# EAGLE design Encoder_robo (EAGLE 9.0.0)
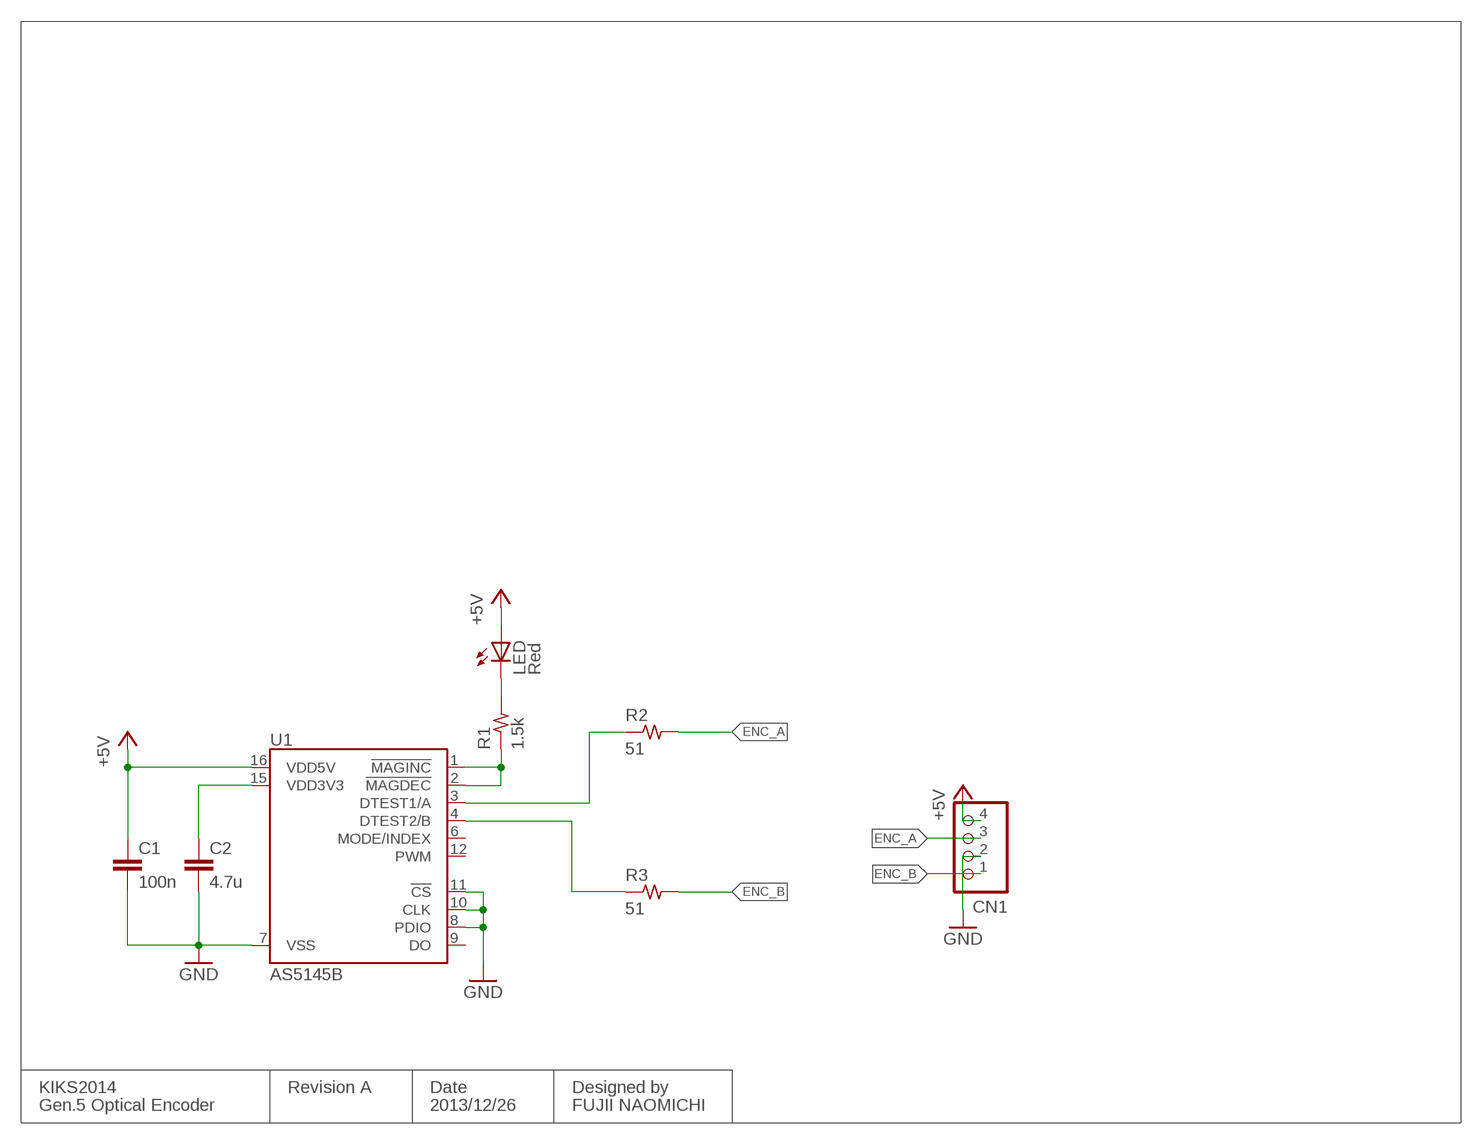
[diagram p0: schematic, sheet 1]

## Parts
C1  100n  C1608  [1608]
C2  4.7u  C1608  [1608]
CN1  S4B-XH-A  [S4B-XH-A]
LED  Red  LED3MM  [LED3MM]
R1  1.5k  R1608  [1608]
R2  51  R1608  [1608]
R3  51  R1608  [1608]
U1  AS5145B  [SSOP16]

## Nets
+5V: C1.1 CN1.4 LED.A U1.16(VDD5V)
ENC_A: CN1.3 R2.2
ENC_B: CN1.1 R3.2
GND: C1.2 C2.2 CN1.2 U1.7(VSS) U1.8(PDIO) U1.10(CLK) U1.11(!CS)
N$1: R2.1 U1.3(DTEST1/A)
N$2: C2.1 U1.15(VDD3V3)
N$3: R3.1 U1.4(DTEST2/B)
N$4: LED.K(C) R1.2
N$5: R1.1 U1.1(!MAGINC) U1.2(!MAGDEC)
Unconnected: U1.6(MODE/INDEX) U1.9(DO) U1.12(PWM)

## Notes on the sheet
- KIKS2014 | Revision A | Date | Designed by
- Gen.5 Optical Encoder | 2013/12/26 | FUJII NAOMICHI

## Library data of the parts
C1 C2 = Passive:C
CN1 = jst-xh:S4B-XH-A: Wire-to-Board 2.5mm pitch side mount connector Source: http://www.jst-mfg.com/product/pdf/jpn/XH.pdf http://www.jst-mfg.com/product/detail.php?series=277
LED = led:LED: LED OSRAM: - CHIPLED LG R971, LG N971, LY N971, LG Q971, LY Q971, LO R971, LY R971 LH N974, LH R974 LS Q976, LO Q976, LY Q976 LO Q996 - Hyper CHIPLED LW Q18S LB Q993, LB Q99A, LB R99A - SideLED LS A670, LO A670, LY A670, LG A670, LP A670 LB A673, LV A673, LT A673, LW A673 LH A674 LY A675 LS A676, LA A676, LO A676, LY A676, LW A676 LS A679, LY A679, LG A679 - Hyper Micro SIDELED® LS Y876, LA Y876, LO Y876, LY Y876 LT Y87S - SmartLED LW L88C, LW L88S LB L89C, LB L89S, LG L890 LS L89K, LO L89K, LY L89K LS L896, LA L896, LO L896, LY L896 - TOPLED LS T670, LO T670, LY T670, LG T670, LP T670 LSG T670, LSP T670, LSY T670, LOP T670, LYG T670 LG T671, LOG T671, LSG T671 LB T673, LV T673, LT T673, LW T673 LH T674 LS T676, LA T676, LO T676, LY T676, LB T676, LH T676, LSB T676, LW T676 LB T67C, LV T67C, LT T67C, LS T67K, LO T67K, LY T67K, LW E67C LS E67B, LA E67B, LO E67B, LY E67B, LB E67C, LV E67C, LT E67C LW T67C LS T679, LY T679, LG T679 LS T770, LO T770, LY T770, LG T770, LP T770 LB T773, LV T773, LT T773, LW T773 LH T774 LS E675, LA E675, LY E675, LS T675 LS T776, LA T776, LO T776, LY T776, LB T776 LHGB T686 LT T68C, LB T68C - Hyper Mini TOPLED® LB M676 - Mini TOPLED Santana® LG M470 LS M47K, LO M47K, LY M47K Source: http://www.osram.convergy.de LUXEON: - LUMILED® LXK2-PW12-R00, LXK2-PW12-S00, LXK2-PW14-U00, LXK2-PW14-V00 LXK2-PM12-R00, LXK2-PM12-S00, LXK2-PM14-U00 LXK2-PE12-Q00, LXK2-PE12-R00, LXK2-PE12-S00, LXK2-PE14-T00, LXK2-PE14-U00 LXK2-PB12-K00, LXK2-PB12-L00, LXK2-PB12-M00, LXK2-PB14-N00, LXK2-PB14-P00, LXK2-PB14-Q00 LXK2-PR12-L00, LXK2-PR12-M00, LXK2-PR14-Q00, LXK2-PR14-R00 LXK2-PD12-Q00, LXK2-PD12-R00, LXK2-PD12-S00 LXK2-PH12-R00, LXK2-PH12-S00 LXK2-PL12-P00, LXK2-PL12-Q00, LXK2-PL12-R00 Source: www.luxeon.com KINGBRIGHT: KA-3528ASYC Source: www.kingbright.com
R1-R3 = Passive:R
U1 = ic-ams:AS5145

## Board
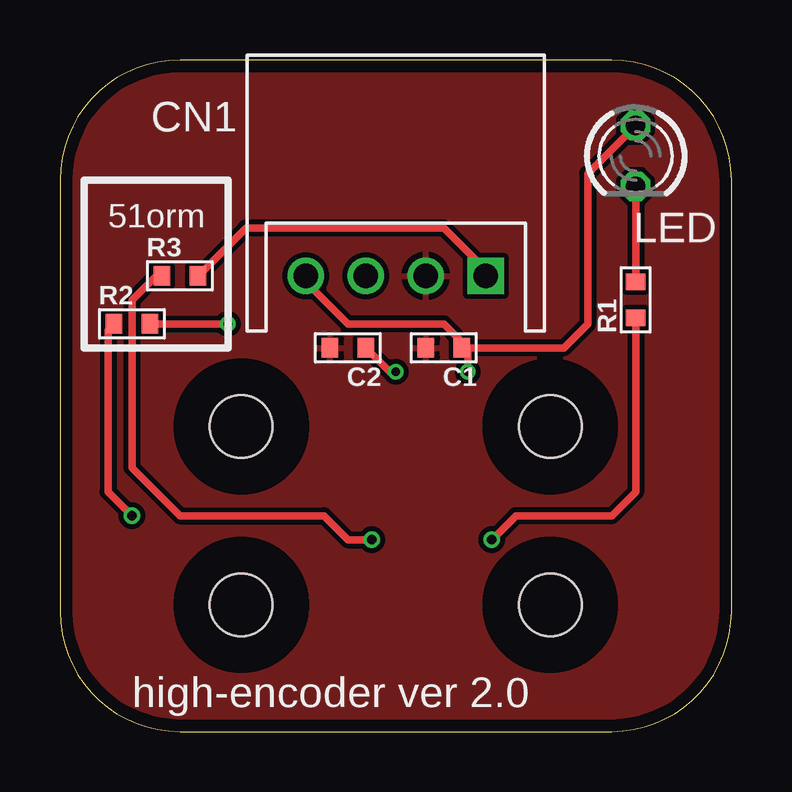
[diagram p1: board, top side]
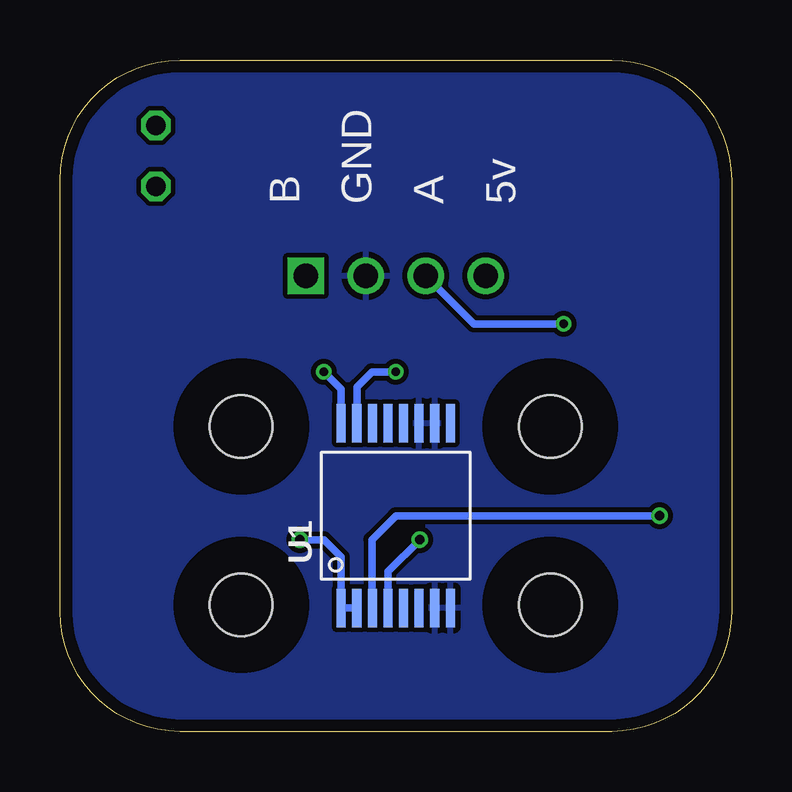
[diagram p2: board, bottom side, seen from below]

Size 28 x 28 mm. Coordinates in mm from the lower left corner, seen from the top.
Outline: 5,0 23,0 arc90 28,5 28,23 arc90 23,28 5,28 arc90 0,23 0,5 arc90 5,0
Copper layers (1*16): Top 0.035mm / dielectric 1.6mm / Bottom 0.035mm
Design rules "Elecrow_2-layer_PCB_eagle_rule": minimum track width 6mil, minimum drill 12mil, track to track 6mil, track to pad 6mil, pad to pad 6mil, via to via 8mil, smd to smd 0mil, copper to edge 20mil, drill to drill 10mil, minimum pad ring 6mil, minimum via ring 6mil, stop-mask expansion 0mil, vias tented up to drill 100mil, thermal gap 10mil
Holes 2.6 mm at 7.56,5.28 20.44,12.72 7.56,12.72 20.44,5.28
tRestrict: area 5.1,2.8 to 10.1,7.8; area 17.9,10.2 to 22.9,15.2; area 5.1,10.2 to 10.1,15.2; area 17.9,2.8 to 22.9,7.8
bRestrict: area 5.1,2.8 to 10.1,7.8; area 17.9,10.2 to 22.9,15.2; area 5.1,10.2 to 10.1,15.2; area 17.9,2.8 to 22.9,7.8

### Footprints (pad centres in the part's own frame; a part is rotated, then mirrored left to right if it is on the bottom)
1608 = smd 0.7 x 0.8: 1 -0.75,0; 2 0.75,0
S4B-XH-A = drill 1.016 square: 1 3.75,0 | drill 1.016: 2 1.25,0; 3 -1.25,0; 4 -3.75,0
LED3MM = drill 0.813 octagon: A -1.27,0; K 1.27,0
SSOP16 = smd 0.381 x 1.6: 1 -2.275,-3.85; 2 -1.625,-3.85; 3 -0.975,-3.85; 4 -0.325,-3.85; 5 0.325,-3.85; 6 0.975,-3.85; 7 1.625,-3.85; 8 2.275,-3.85; 9 2.275,3.85; 10 1.625,3.85; 11 0.975,3.85; 12 0.325,3.85; 13 -0.325,3.85; 14 -0.975,3.85; 15 -1.625,3.85; 16 -2.275,3.85

### Placement (x,y rotation side)
C1  16,16 180 top
C2  12,16 180 top
CN1  14,19 0 top
LED  24,24 270 top
R1  24,18 90 top
R2  3,17 0 top
R3  5,19 0 top
U1  14,9 0 bottom

### Tracks (layer width: path | path; a pad name or v marks a point on that pad's centre or on a via)
+5V  (via drill 0.35)
  Top 0.305: LED.A 22,23.27 22,17 21,16 17,16 | 17,16 C1.1 16.75,16.25 16,17 12,17 10.25,18.75 CN1.4 | v17,15 17,16
  Bottom 0.305: U1.16 16.27,14.28 v17,15
ENC_A  (via drill 0.35)
  Top 0.305: R2.2 v7,17
  Bottom 0.305: v7,17 10.75,17 CN1.3
ENC_B
  Top 0.305: R3.2 7.75,21 16,21 17.75,19.25 CN1.1
GND
  pour Top (isolate 0.2, rank 6): -1,29 29,29 29,-1 -1,-1
  pour Bottom (isolate 0.2, rank 6): -1,29 29,29 29,-1 -1,-1
N$1  (via drill 0.4)
  Top 0.305: v3,9 2,10 2,16.75 R2.1
  Bottom 0.305: v3,9 14,9 15,8 15,5.17 U1.3
N$2  (via drill 0.35)
  Top 0.305: v14,15 13.75,15 C2.1
  Bottom 0.305: U1.15 15.62,14.38 15,15 v14,15
N$3  (via drill 0.4)
  Top 0.305: v13,8 12,8 11,9 5,9 3,11 3,18 4,19 R3.1
  Bottom 0.305: U1.4 14.32,6.67 v13,8
N$4
  Top 0.305: LED.K R1.2
N$5  (via drill 0.4)
  Top 0.305: R1.1 24,10 23,9 19,9 v18,8
  Bottom 0.305: v18,8 17,8 16.27,7.28 U1.1 U1.2

### Text on the board
tNames: 51orm | high-encoder ver 2.0
bNames: 5v | A | GND | B